# EAGLE board boatcc (EAGLE 9.2.1)
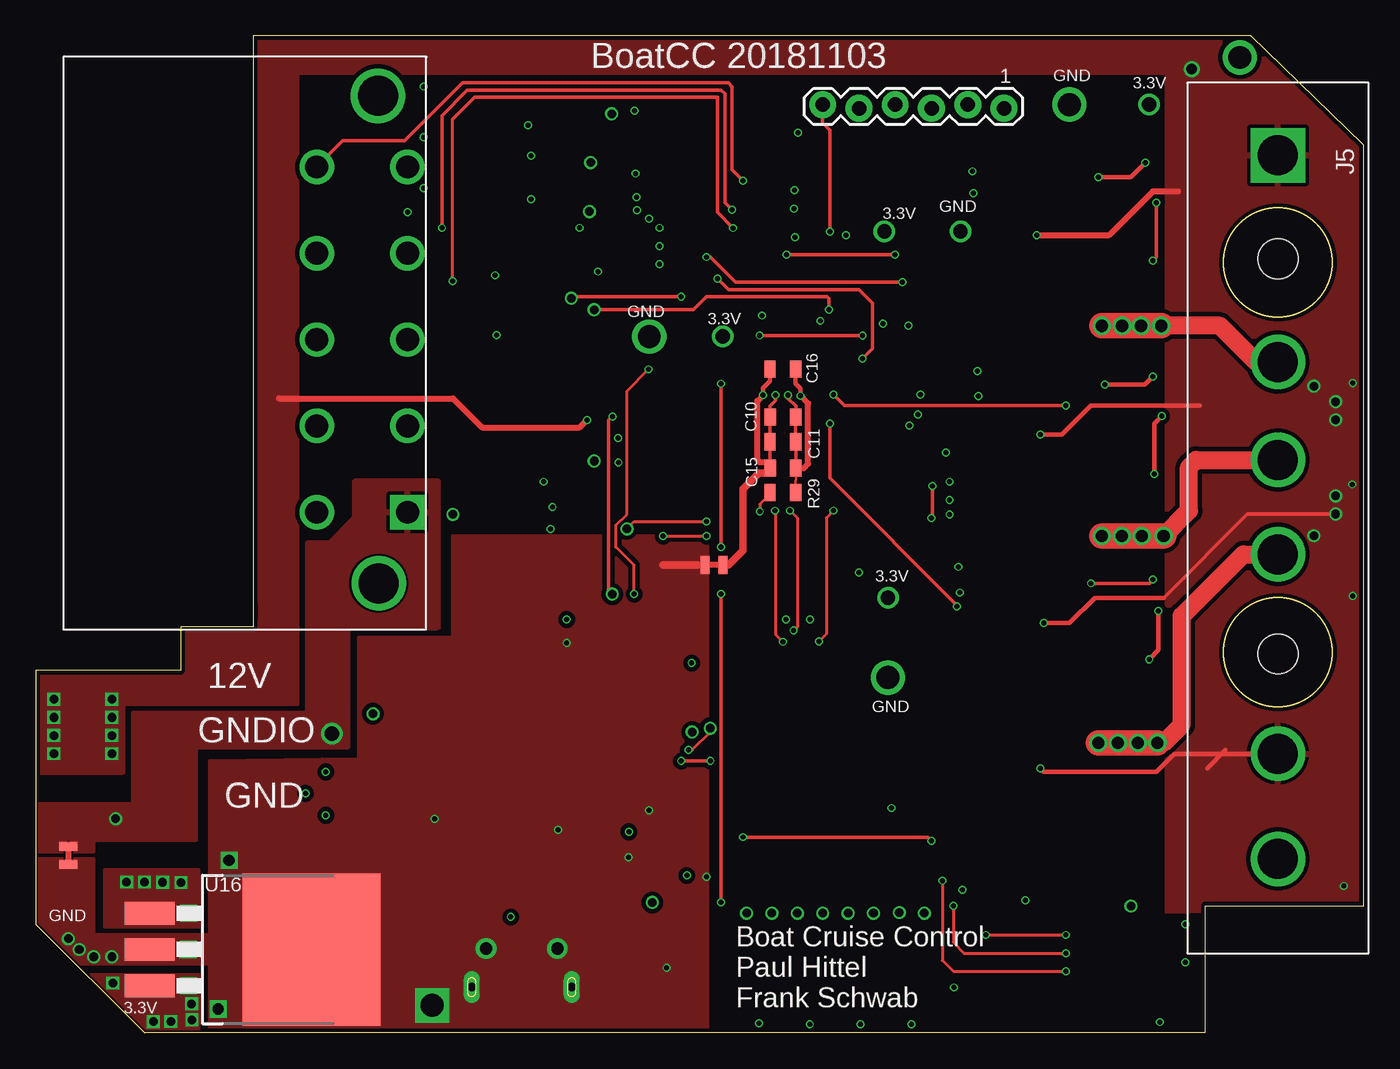
[diagram p2: board, top side]
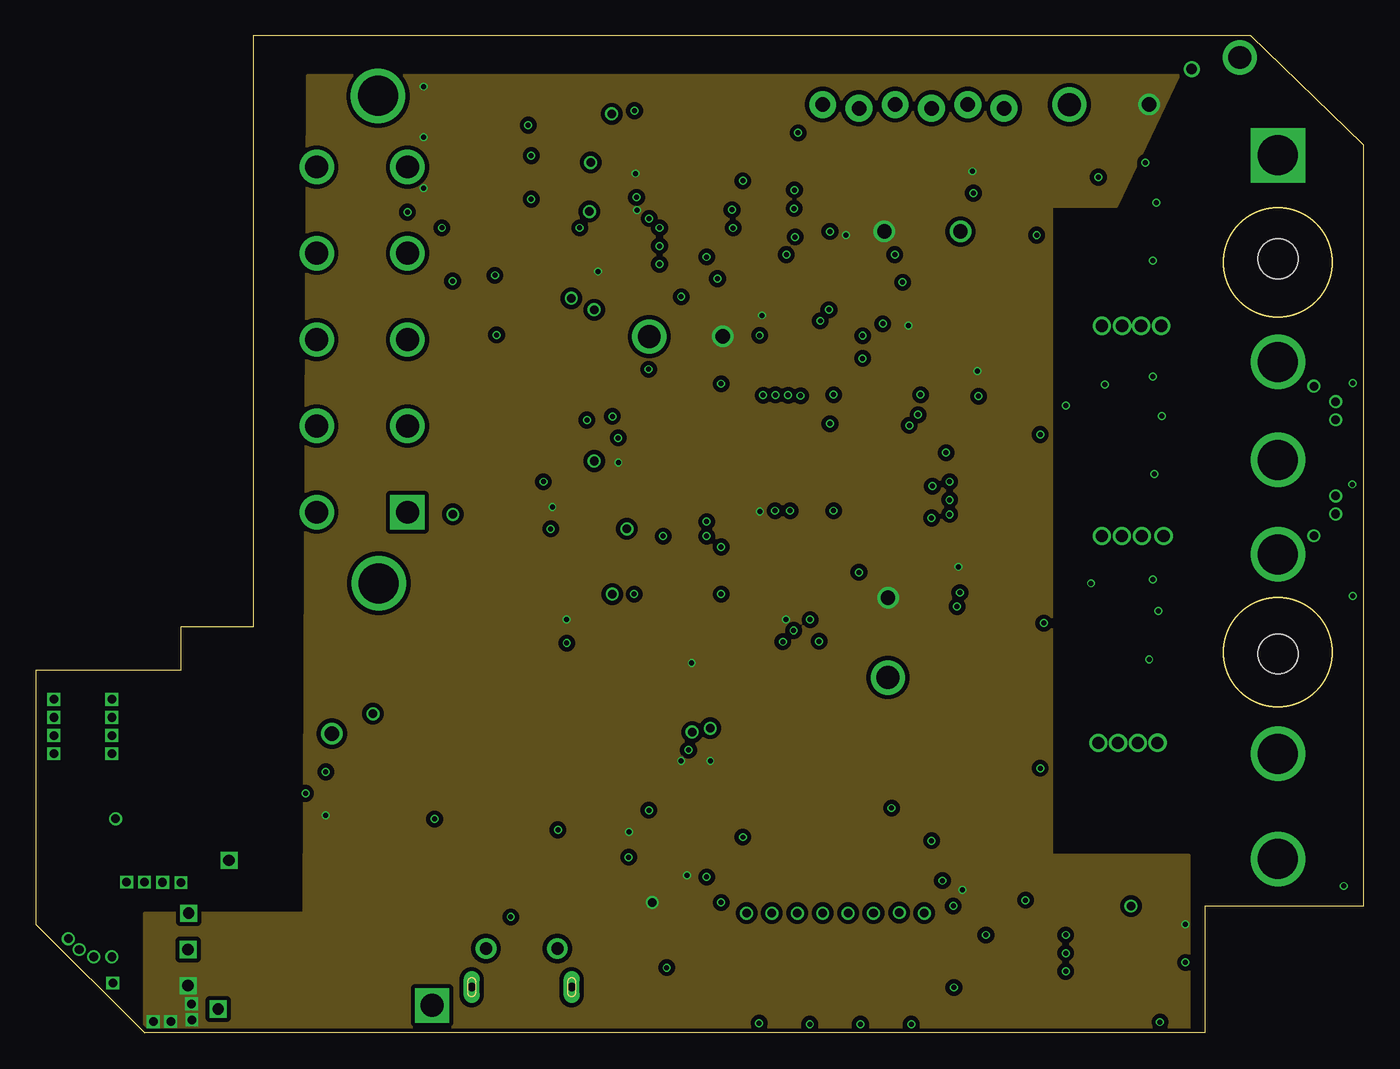
[diagram p3: board, inner layer $3.3V]
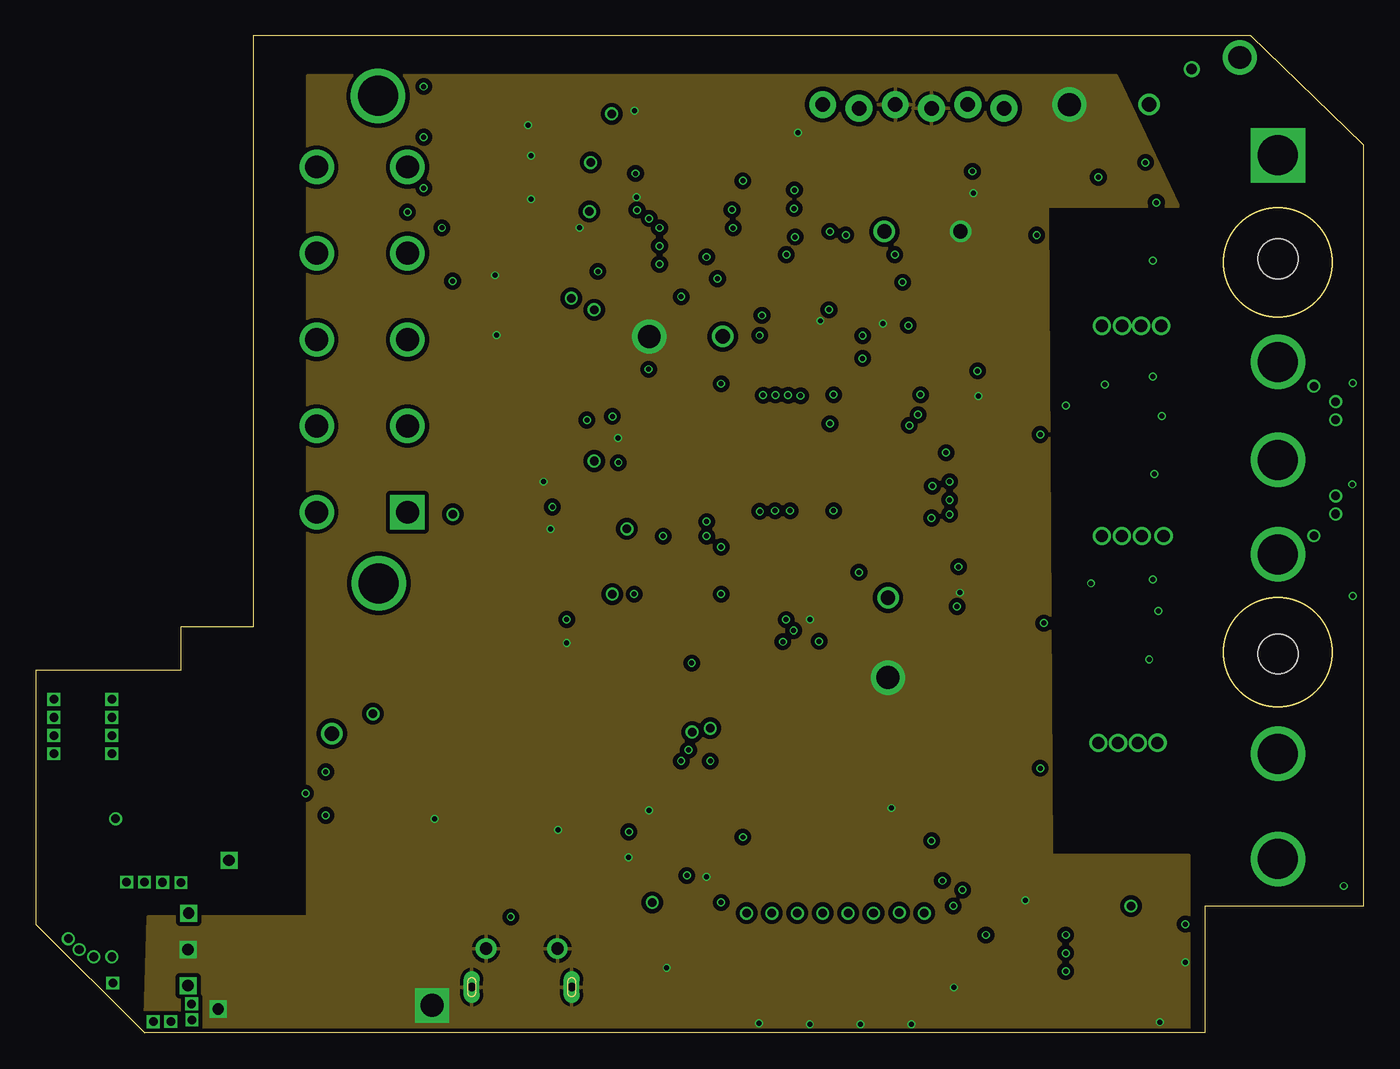
[diagram p4: board, inner layer $Gnd]
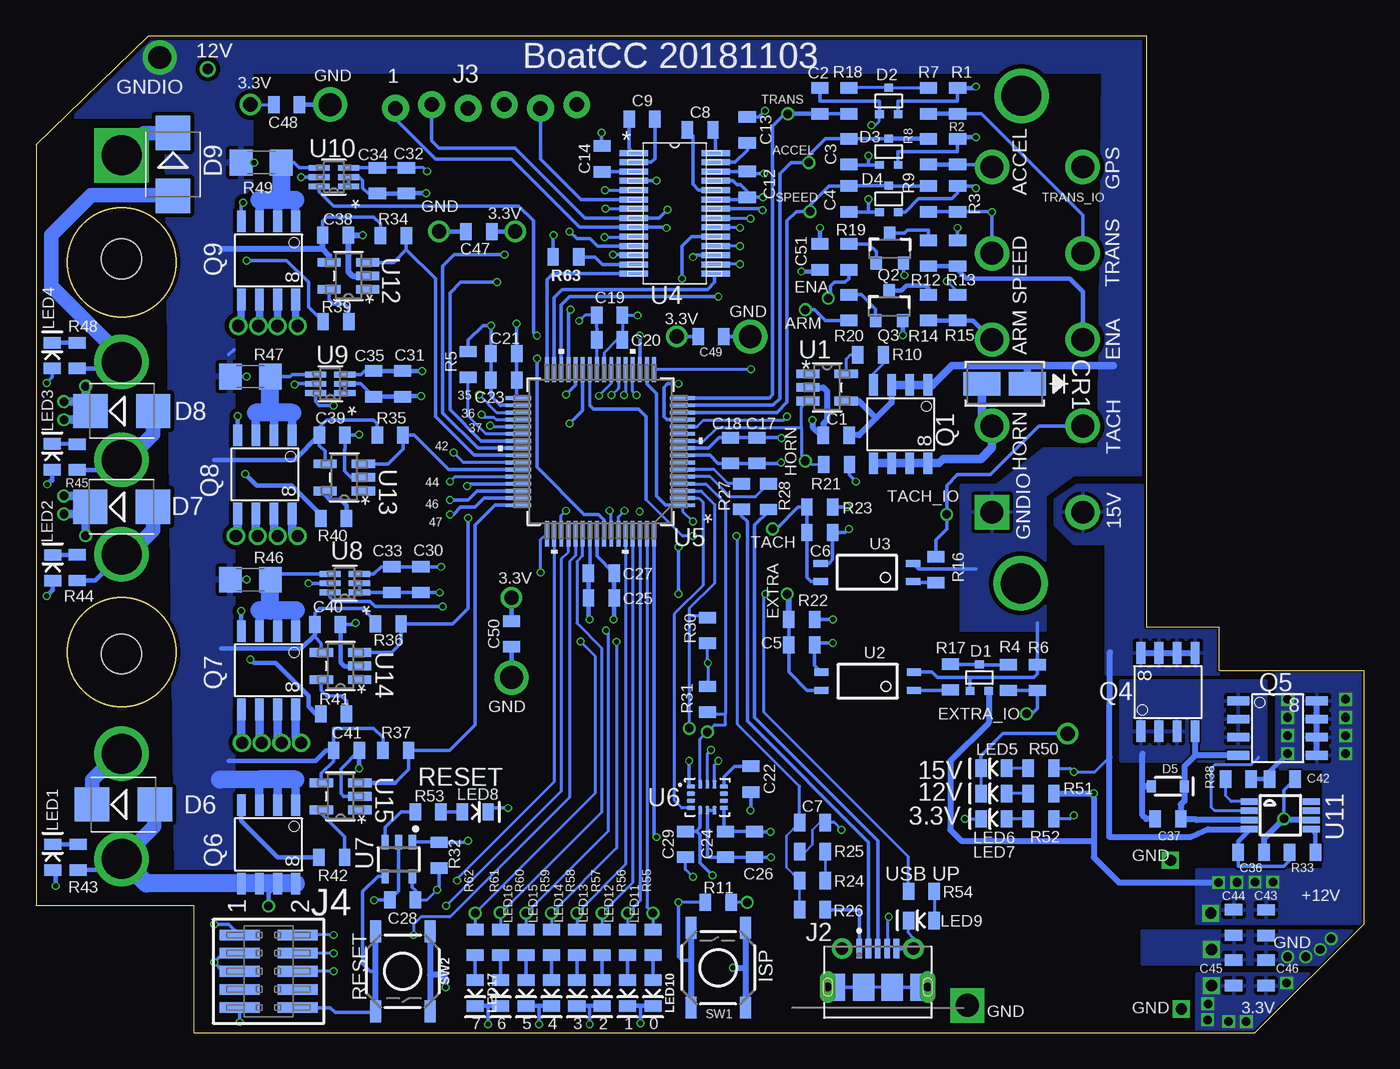
[diagram p5: board, bottom side, seen from below]

Size 93.02 x 69.85 mm. Coordinates in mm from the lower left corner, seen from the top.
Outline: 92.96,8.89 81.92,8.89 81.92,0 7.62,0 0,7.62 0,25.4 10.16,25.4 10.16,28.45 15.24,28.45 15.24,69.85 85.09,69.85 92.96,62.23 92.96,8.89
Outline: 92.96,8.89 93.02,8.89
Outline: circle at 87,26.67 radius 3.81
Outline: circle at 87,53.98 radius 3.81
Copper layers (1*2+15*16): Top 0.035mm / dielectric 0.12mm / $3.3V 0.0175mm / dielectric 1.2mm / $Gnd 0.0175mm / dielectric 0.12mm / Bottom 0.035mm
Design rules "SmartPrototypingEagle Rule_4layer": minimum track width 6mil, minimum drill 12mil, track to track 6mil, track to pad 6mil, pad to pad 6mil, via to via 6mil, smd to smd 0mil, copper to edge 6mil, drill to drill 12mil, minimum pad ring 10mil, minimum via ring 4mil, stop-mask expansion 2mil, vias tented up to drill 25mil, thermal gap 10mil

## Footprints (pad centres in the part's own frame; a part is rotated, then mirrored left to right if it is on the bottom)
0805 = smd 0.8 x 1.2: 1 -0.9,0; 2 0.9,0
SMASERIES-M = smd 2.591 x 1.651: 1 -1.6,0; 2 1.6,0
SC70 = smd 0.6 x 0.55: 1 -0.65,-0.925; 2 0.65,-0.925; 3 0,0.925
SOD-323 = smd 0.63 x 0.83: A 1.15,0; C -1.15,0
SMB = smd 2.4 x 2.4: A 2.2,0; C -2.2,0
CONN_IO = drill 1.6 square: A 18.136,6.35 | drill 1.6: B 12.09,6.35; C 6.045,6.35; D 0,6.35; E -6.045,6.35; F -6.045,0; G 0,0; H 6.045,0; J 12.09,0; K 18.136,0 | drill 2.8: LOC1 -11.024,4.293; LOC2 23.114,4.343
MOLEX_1050170001 = smd 0.4 x 1.35: 1 -1.3,2.35; 2 -0.65,2.35; 3 0,2.35; 4 0.65,2.35; 5 1.3,2.35 | drill 0.85 pad 1.45: SH1 -2.5,2.35; SH2 2.5,2.35 | drill 0.6 pad 0.95 long: SH3 -3.5,-0.35; SH8 3.5,-0.35 | smd 1.2 x 1.9: SH4 -2.9,-0.35; SH7 2.9,-0.35 | smd 1.5 x 1.9: SH5 -1,-0.35; SH6 1,-0.35
1X06_LOCK = drill 1.016 pad 1.88: 1 0,0; 2 2.54,-0.254; 3 5.08,0; 4 7.62,-0.254; 5 10.16,0; 6 12.7,-0.254
SAMTEC-FTSH-105-01-X-DV = smd 0.74 x 2.79: 1 -2.54,-2.032; 2 -2.54,2.032; 3 -1.27,-2.032; 4 -1.27,2.032; 5 0,-2.032; 6 0,2.032; 7 1.27,-2.032; 8 1.27,2.032; 9 2.54,-2.032; 10 2.54,2.032
CONN_MOTOR = drill 2.8 square: 1 0,0 | drill 2.8: 2 14.478,0; 3 21.336,0; 4 27.94,0; 5 41.91,0; 6 49.276,0 | hole 2.8: 7.239,0; 34.925,0
LED_0805 = smd 0.8 x 1.2: A -0.9,0; C 0.9,0
SO-8 = smd 1.524 x 0.61: 1 -2.743,1.905; 2 -2.743,0.635; 3 -2.743,-0.635; 4 -2.743,-1.905; 5 2.743,-1.905; 6 2.743,-0.635; 7 2.743,0.635; 8 2.743,1.905
SOT23-3 = smd 0.8 x 0.9: 1 -0.95,-1; 2 0.95,-1; 3 0,1.1
1206 = smd 1.6 x 1.8: 1 -1.4,0; 2 1.4,0
2PT_GND_TIE = smd 1.27 x 0.635: P$1 0,0.635; P$2 0,-0.635
TACTILE_SWITCH_SMD_5.2MM = smd 1.524 x 0.762: 1 -2.794,1.905; 2 2.794,1.905; 3 -2.794,-1.905; 4 2.794,-1.905
SOT-23-5_MC-M = smd 1.626 x 0.61: 1 -1.346,0.95; 2 -1.346,0; 3 -1.346,-0.95; 4 1.346,-0.95; 5 1.346,0.95
MINI-FLAT-4 = smd 1 x 0.5: 1 -3.24,0.635; 2 -3.24,-0.635; 3 3.24,-0.635; 4 3.24,0.635
PW28-M = smd 1.981 x 0.406: 1 -2.87,4.216; 2 -2.87,3.581; 3 -2.87,2.921; 4 -2.87,2.286; 5 -2.87,1.626; 6 -2.87,0.965; 7 -2.87,0.33; 8 -2.87,-0.33; 9 -2.87,-0.965; 10 -2.87,-1.626; 11 -2.87,-2.286; 12 -2.87,-2.921; 13 -2.87,-3.581; 14 -2.87,-4.216; 15 2.87,-4.216; 16 2.87,-3.581; 17 2.87,-2.921; 18 2.87,-2.286; 19 2.87,-1.626; 20 2.87,-0.965; 21 2.87,-0.33; 22 2.87,0.33; 23 2.87,0.965; 24 2.87,1.626; 25 2.87,2.286; 26 2.87,2.921; 27 2.87,3.581; 28 2.87,4.216
LQFP64_10X10-M = smd 1.766 x 0.27: 1 -5.751,3.75; 2 -5.751,3.25; 3 -5.751,2.75; 4 -5.751,2.25; 5 -5.751,1.75; 6 -5.751,1.25; 7 -5.751,0.75; 8 -5.751,0.25; 9 -5.751,-0.25; 10 -5.751,-0.75; 11 -5.751,-1.25; 12 -5.751,-1.75; 13 -5.751,-2.25; 14 -5.751,-2.75; 15 -5.751,-3.25; 16 -5.751,-3.75; 33 5.751,-3.75; 34 5.751,-3.25; 35 5.751,-2.75; 36 5.751,-2.25; 37 5.751,-1.75; 38 5.751,-1.25; 39 5.751,-0.75; 40 5.751,-0.25; 41 5.751,0.25; 42 5.751,0.75; 43 5.751,1.25; 44 5.751,1.75; 45 5.751,2.25; 46 5.751,2.75; 47 5.751,3.25; 48 5.751,3.75 | smd 0.27 x 1.766: 17 -3.75,-5.751; 18 -3.25,-5.751; 19 -2.75,-5.751; 20 -2.25,-5.751; 21 -1.75,-5.751; 22 -1.25,-5.751; 23 -0.75,-5.751; 24 -0.25,-5.751; 25 0.25,-5.751; 26 0.75,-5.751; 27 1.25,-5.751; 28 1.75,-5.751; 29 2.25,-5.751; 30 2.75,-5.751; 31 3.25,-5.751; 32 3.75,-5.751; 49 3.75,5.751; 50 3.25,5.751; 51 2.75,5.751; 52 2.25,5.751; 53 1.75,5.751; 54 1.25,5.751; 55 0.75,5.751; 56 0.25,5.751; 57 -0.25,5.751; 58 -0.75,5.751; 59 -1.25,5.751; 60 -1.75,5.751; 61 -2.25,5.751; 62 -2.75,5.751; 63 -3.25,5.751; 64 -3.75,5.751
PQFN50P250X300X97-14N = smd 0.61 x 0.3: 1 -1.16,0.75; 2 -1.16,0.25; 3 -1.16,-0.25; 4 -1.16,-0.75; 8 1.16,-0.75; 9 1.16,-0.25; 10 1.16,0.25; 11 1.16,0.75 | smd 0.3 x 0.61: 5 -0.5,-0.91; 6 0,-0.91; 7 0.5,-0.91; 12 0.5,0.91; 13 0,0.91; 14 -0.5,0.91
SOT23-5 = smd 0.5 x 1: 1 -0.95,-1.2; 2 0,-1.2; 3 0.95,-1.2; 4 0.95,1.2; 5 -0.95,1.2
DCK6-M = smd 1.473 x 0.406: 1 -1.029,0.65; 2 -1.029,0; 3 -1.029,-0.65; 4 1.029,-0.65; 5 1.029,0; 6 1.029,0.65
UMAX8 = smd 0.45 x 1.2: 1 -0.975,-2.175; 2 -0.325,-2.175; 3 0.325,-2.175; 4 0.975,-2.175; 5 0.975,2.175; 6 0.325,2.175; 7 -0.325,2.175; 8 -0.975,2.175
D2PACK/A = smd 1.6 x 3.5: 1 -2.54,-8.275; 2 0,-8.275; 3 2.54,-8.275 | smd 10.668 x 9.652: TAB 0,3.08

## Placement (x,y rotation side)
C1  100nf  [0805]  36.95,41.86 0 bottom
C2  100nf  [0805]  38.1,65.28 90 bottom
C3  100nf  [0805]  36.07,61.72 270 bottom
C4  100nf  [0805]  36.07,58.42 270 bottom
C5  100nf  [0805]  39.37,27.18 0 bottom
C6  100nf  [0805]  38.1,35.05 0 bottom
C7  100nf  [0805]  38.61,14.73 0 bottom
C8  100nf  [0805]  46.48,63.25 180 bottom
C9  100nf  [0805]  50.55,64.01 0 bottom
C10  1uf  [0805]  52.33,43.14 0 top
C11  10nf  [0805]  52.32,41.4 0 top
C12  100nf  [0805]  43.18,59.44 270 bottom
C13  100nf  [0805]  43.18,63.25 90 bottom
C14  100nf  [0805]  53.34,61.21 90 bottom
C15  10uf  [0805]  52.33,39.57 180 top
C16  100nf  [0805]  52.33,46.5 180 top
C17  100nf  [0805]  42.5,40.8 90 bottom
C18  10nf  [0805]  44.36,40.8 90 bottom
C19  100nf  [0805]  52.83,50.27 180 bottom
C20  10nf  [0805]  52.83,48.55 180 bottom
C21  100nf  [0805]  60.23,47.59 0 bottom
C22  100nf  [0805]  42.93,17.78 270 bottom
C23  10nf  [0805]  60.23,45.72 0 bottom
C24  100nf  [0805]  44.7,13.21 270 bottom
C25  100nf  [0805]  53.4,30.46 180 bottom
C26  1uf  [0805]  42.67,13.21 270 bottom
C27  10nf  [0805]  53.41,32.19 180 bottom
C28  100nf  [0805]  67.32,9.32 180 bottom
C29  10nf  [0805]  47.51,13.21 270 bottom
C30  100nf  [0805]  66.04,31.75 90 bottom
C31  100nf  [0805]  67.31,45.47 90 bottom
C32  100nf  [0805]  67.06,59.69 90 bottom
C33  10nf  [0805]  68.07,31.75 90 bottom
C34  10nf  [0805]  69.09,59.69 90 bottom
C35  10nf  [0805]  69.34,45.47 90 bottom
C36  100nf  [0805]  7.9,12.65 0 bottom
C37  10nf  [0805]  13.72,14.99 0 bottom
C38  100nf  [0805]  72.02,55.88 180 bottom
C39  100nf  [0805]  72.25,41.87 180 bottom
C40  100nf  [0805]  72.56,28.61 180 bottom
C41  100nf  [0805]  71.25,19.78 180 bottom
C42  10uf  [0805]  5.7,17.78 0 bottom
C43  10uf  [0805]  6.85,7.72 270 bottom
C44  100nf  [0805]  9.12,7.74 270 bottom
C45  100nf  [0805]  9.12,4.21 90 bottom
C46  10uf  [0805]  6.85,4.21 90 bottom
C47  1uf  [0805]  61.98,56.13 180 bottom
C48  10uf  [0805]  75.44,65.02 0 bottom
C49  1uf  [0805]  45.72,48.77 0 bottom
C50  1uf  [0805]  59.69,27.94 270 bottom
C51  10uf  [0805]  38.1,54.36 90 bottom
CR1  SMAJ45CASMASERIES-M  [SMASERIES-M]  25.15,45.47 180 bottom
D1  BAV99WT1  [SC70]  26.92,24.89 0 bottom
D2  BAV99WT1  [SC70]  33.27,65.28 0 bottom
D3  BAV99WT1  [SC70]  33.27,61.72 0 bottom
D4  BAV99WT1  [SC70]  33.27,58.42 0 bottom
D5  18V  [SOD-323]  13.72,17.27 180 bottom
D6  ES2D  [SMB]  86.87,16 0 bottom
D7  ES2D  [SMB]  86.99,36.85 0 bottom
D8  ES2D  [SMB]  86.99,43.56 0 bottom
D9  ES2D  [SMB]  83.4,60.83 270 bottom
J1  CONN_IOALT  [CONN_IO]  19.68,54.61 270 top
J2  CONN_USB_MICRO  [MOLEX_1050170001]  34.04,3.56 0 bottom
J3  CONN_SERIAL  [1X06_LOCK]  67.82,64.77 180 top
J4  FTSH-105-01  [SAMTEC-FTSH-105-01-X-DV]  76.71,4.32 270 bottom
J5  CONN_MOTOR  [CONN_MOTOR]  87,61.47 270 top
LED1  Green  [LED_0805]  91.83,12.31 90 bottom
LED2  Green  [LED_0805]  91.83,32.58 90 bottom
LED3  Green  [LED_0805]  91.85,40.36 90 bottom
LED4  Green  [LED_0805]  91.85,47.45 90 bottom
LED5  Green  [LED_0805]  25.91,18.54 180 bottom
LED6  Green  [LED_0805]  25.91,16.76 180 bottom
LED7  Green  [LED_0805]  25.91,14.99 180 bottom
LED8  Red  [LED_0805]  62.23,15.49 0 bottom
LED9  Green  [LED_0805]  30.99,7.87 180 bottom
LED10  Green  [LED_0805]  49.78,2.79 270 bottom
LED11  Green  [LED_0805]  51.56,2.79 270 bottom
LED12  Green  [LED_0805]  53.34,2.79 270 bottom
LED13  Green  [LED_0805]  55.12,2.79 270 bottom
LED14  Green  [LED_0805]  56.9,2.79 270 bottom
LED15  Green  [LED_0805]  58.67,2.79 270 bottom
LED16  Green  [LED_0805]  60.45,2.79 270 bottom
LED17  Red  [LED_0805]  62.23,2.79 270 bottom
Q1  SI4190DY  [SO-8]  32.44,42.65 270 bottom
Q2  2N3904  [SOT23-3]  33.19,54.91 0 bottom
Q3  2N3904  [SOT23-3]  33.24,50.88 0 bottom
Q4  SI4190DY  [SO-8]  13.72,23.88 90 bottom
Q5  SI4190DY  [SO-8]  6.04,21.34 0 bottom
Q6  SI4190DY  [SO-8]  76.71,13.21 270 bottom
Q7  SI4190DY  [SO-8]  76.71,25.4 270 bottom
Q8  SI4190DY  [SO-8]  76.96,39.12 270 bottom
Q9  SI4190DY  [SO-8]  76.71,54.1 270 bottom
R1  1k  [0805]  28.45,65.28 270 bottom
R2  49.9  [0805]  28.45,61.72 270 bottom
R3  49.9  [0805]  28.45,58.42 270 bottom
R4  DNP  [0805]  22.86,24.89 90 bottom
R5  10k  [0805]  62.74,46.83 270 bottom
R6  1k  [0805]  24.89,24.89 270 bottom
R7  1k  [0805]  30.48,65.28 270 bottom
R8  4k7  [0805]  30.48,61.72 270 bottom
R9  4k7  [0805]  30.48,58.42 270 bottom
R10  33  [0805]  34.54,47.5 180 bottom
R11  10k  [0805]  45.21,9.14 0 bottom
R12  620  [0805]  30.48,54.61 270 bottom
R13  DNP  [0805]  28.45,54.61 270 bottom
R14  620  [0805]  30.48,50.8 270 bottom
R15  DNP  [0805]  28.45,50.8 270 bottom
R16  1k  [0805]  29.97,32.44 90 bottom
R17  1k  [0805]  28.95,24.92 90 bottom
R18  1k  [0805]  36.07,65.28 90 bottom
R19  1k  [0805]  36.07,54.36 90 bottom
R20  1k  [0805]  36.07,50.8 90 bottom
R21  10k  [0805]  36.92,39.82 0 bottom
R22  1k  [0805]  39.37,28.96 0 bottom
R23  1k  [0805]  38.1,36.83 0 bottom
R24  10k  [0805]  38.61,10.67 180 bottom
R25  10k  [0805]  38.61,12.7 0 bottom
R26  10k  [0805]  38.61,8.64 0 bottom
R27  33  [0805]  43.58,37.58 90 bottom
R28  33  [0805]  41.69,37.56 90 bottom
R29  100  [0805]  52.32,37.84 0 top
R30  10k  [0805]  45.97,28.19 270 bottom
R31  10k  [0805]  45.97,23.37 90 bottom
R32  10k  [0805]  64.77,12.45 90 bottom
R33  10k  [0805]  4.29,12.65 0 bottom
R34  10k  [0805]  67.97,55.84 180 bottom
R35  10k  [0805]  68.19,41.87 180 bottom
R36  10k  [0805]  68.32,28.63 180 bottom
R37  10k  [0805]  67.8,19.8 180 bottom
R38  100  [0805]  8.8,17.78 0 bottom
R39  33  [0805]  71.98,49.81 180 bottom
R40  33  [0805]  72.15,36.04 180 bottom
R41  33  [0805]  72.15,22.35 180 bottom
R42  33  [0805]  72.28,12.3 180 bottom
R43  3k  [0805]  90.03,12.31 90 bottom
R44  1k  [0805]  90.11,32.59 90 bottom
R45  1k  [0805]  90.12,40.33 90 bottom
R46  R015  [1206]  77.98,31.75 0 bottom
R47  R015  [1206]  77.98,45.97 0 bottom
R48  1k  [0805]  90.12,47.45 90 bottom
R49  R015  [1206]  77.22,60.96 0 bottom
R50  3k  [0805]  22.61,18.54 0 bottom
R51  3k  [0805]  22.61,16.76 0 bottom
R52  350  [0805]  22.61,14.99 0 bottom
R53  350  [0805]  65.53,15.49 180 bottom
R54  350  [0805]  30.99,9.91 180 bottom
R55  350  [0805]  49.78,6.35 90 bottom
R56  350  [0805]  51.56,6.35 90 bottom
R57  350  [0805]  53.34,6.35 90 bottom
R58  350  [0805]  55.12,6.35 90 bottom
R59  350  [0805]  56.9,6.35 90 bottom
R60  350  [0805]  58.67,6.35 90 bottom
R61  350  [0805]  60.45,6.35 90 bottom
R62  350  [0805]  62.23,6.35 90 bottom
R63  10k  [0805]  55.88,54.36 180 bottom
SUPPLY1  2PT_GND_TIE  [2PT_GND_TIE]  47.5,32.77 270 top
SUPPLY2  2PT_GND_TIE  [2PT_GND_TIE]  2.29,12.45 0 top
SW1  [TACTILE_SWITCH_SMD_5.2MM]  45.21,4.57 90 bottom
SW2  [TACTILE_SWITCH_SMD_5.2MM]  67.31,4.32 270 bottom
U1  MCP1416  [SOT-23-5_MC-M]  37.59,45.21 0 bottom
U2  TLP292  [MINI-FLAT-4]  34.75,24.63 180 bottom
U3  TLP292  [MINI-FLAT-4]  34.8,32.26 180 bottom
U4  MAX3243  [PW28-M]  48.26,57.4 0 bottom
U5  LPC54114  [LQFP64_10X10-M]  53.46,40.71 180 bottom
U6  ICM-20600  [PQFN50P250X300X97-14N]  45.97,16.51 0 bottom
U7  MCP1319M  [SOT23-5]  67.59,12.17 180 bottom
U8  INA213B  [DCK6-M]  71.37,31.5 180 bottom
U9  INA213B  [DCK6-M]  72.39,45.47 180 bottom
U10  INA213B  [DCK6-M]  72.14,59.94 180 bottom
U11  MAX16128  [UMAX8]  5.84,15.24 270 bottom
U12  MCP1416  [SOT-23-5_MC-M]  71.11,53.02 180 bottom
U13  MCP1416  [SOT-23-5_MC-M]  71.41,38.91 180 bottom
U14  MCP1416  [SOT-23-5_MC-M]  71.67,25.7 180 bottom
U15  MCP1416  [SOT-23-5_MC-M]  71.66,16.57 180 bottom
U16  Recom R-78E3.3-0.5  [D2PACK/A]  16.26,5.84 270 top

## Tracks (layer width: path | path; a pad name or v marks a point on that pad's centre or on a via)
3.3V  (via drill 0.35, 0.6, 0.8, 1)
  Top 0.203: R29.1 51.13,37.55 51.13,37.46 50.71,37.04 v50.71,36.53
  Top 0.254: v45.21,19.05 v47.24,19.05
  Bottom 0.203: v43.18,9.14 R11.2 | R52.2 20.57,14.99 v20.32,15.24 | v77.98,65.02 C48.1 | U5.24 53.21,47.63 52.29,48.55 C20.1 C19.1 v50.87,50.27 v50.87,50.26 | C28.1 65.61,9.32 v64.91,10.02 | R30.2 45.97,25.94 v45.95,25.91 45.95,24.3 R31.2 | v65.6,60.34 65.85,60.59 C32.2 C34.2 | U6.12 45.47,18.79 v45.21,19.05
  Bottom 0.254: v27.18,59.18 27.32,59.32 R3.1 28.45,58.81 28.84,58.42 31.19,58.42 32.12,57.49 D4.2 | U4.26 45.43,60.34 C12.1 43.18,60.2 v42.01,60.2 | v40.8,39.94 40.85,39.9 C17.1 C18.1 45.23,39.9 45.8,40.46 U5.8 | R2.1 28.45,61.72 32.62,61.72 D3.2 | R1.1 28.45,65.28 32.62,65.28 D2.2 | C27.1 53.71,33.4 U5.56 | C49.1 46.63,48.78 v48.12,48.78 | v80.52,7.62 79.5,7.62 J4.1 | U4.22 42.22,57.73 v42.12,57.63 | v41.54,14.08 42.65,14.08 C26.1 C24.1 44.81,14.22 U6.8 | C28.1 66.42,9.99 66.64,10.21 U7.5 | U5.34 60.43,43.96 60.45,43.94 61.13,44.62 C23.1 C21.1 61.11,47.6 v61.11,49.56 61.7,49.56 62.74,48.51 R5.1 | C29.1 46.75,14.11 | 46.75,14.11 46.5,13.86 46.5,11.93 v45.61,11.03 | v64.91,10.02 64.77,10.16 R32.1 | U8.3 69.34,32.15 68.83,32.65 C33.2 C30.2 v64.64,32.65 | 46.75,14.11 46.47,14.39 U6.5 | U6.1 47.24,17.37 v47.24,19.05 | R23.2 v36.19,36.83 v36.18,36.84 | v37.19,28.96 R22.2 | C35.2 69.97,46.37 70.22,46.12 U9.3 | C34.2 U10.3 | R63.2 56.78,55.84 v56.74,55.88
  Bottom 0.305: v27.18,62.74 28.33,62.74 R2.1 | R1.1 27.29,66.18 v27.18,66.29 | v39.37,53.34 38.22,53.34 C51.1 | v52.55,28.96 52.5,29.01 C25.1 52.5,32.19 C27.1 | v59.44,56.13 C47.1 | C50.1 v59.69,30.48 | v65.96,46.37 C31.2 C35.2
  other vias: 10.67,3.31 10.94,0.91 9.46,0.8 10.92,2.03 8.24,0.79 5.41,3.49
  pour Bottom: 11.68,4.11 3.02,4.11 5.08,0 11.68,0
  pour $3.3V (isolate 0.305): 19.05,67.06 80.01,67.06 75.69,57.91 71.12,57.91 71.12,12.45 80.77,12.45 80.77,0 7.62,0 7.62,8.38 18.8,8.38
  pour Top (no thermals): 11.43,4.06 2.92,4.06 4.95,0 11.43,0
+12V  (via drill 0.35, 0.6, 0.75, 0.8)
  Top 0.254: v91.05,36.34 84.86,36.34 78.99,30.48
  Top 0.305: 81.53,43.94 73.91,43.94 71.88,41.91 v70.36,41.91 | 82.04,18.54 83.31,19.81 | J5.5 79.76,19.56 78.49,18.29 70.61,18.29 v70.36,18.54 | v70.61,28.7 72.39,28.7 74.17,30.48 78.99,30.48
  Top 0.406: v38.61,42.93 38.1,42.42 31.25,42.42 29.22,44.45 17.02,44.45 | 80.01,58.93 78.23,58.93 75.18,55.88 v70.1,55.88
  Bottom 0.203: 18.91,16.51 18.9,16.53 v18.9,16.78 18.91,16.76
  Bottom 0.254: v92.25,45.53 91.85,45.93 LED4.A | U13.2 70.92,38.91 71.37,39.37 71.37,40.89 71.35,40.91 C39.1 70.4,41.87 v70.36,41.91 | v70.11,55.88 v70.1,55.88 | C38.1 | U14.2 70.36,25.65 | C40.1 70.7,28.61 v70.61,28.7 | C41.1 71.63,18.5 71.63,16.76 71.43,16.57 U15.2
  Bottom 0.305: v5.33,19.56 6.6,18.29 C42.1 R38.2 | 70.36,25.65 71.37,25.65 71.66,25.94 C40.1 | v91.62,10.29 91.62,11.21 LED1.A | LED3.A 91.85,38.68 91.95,38.68 v92.2,38.43 | LED2.A 91.83,31.01 v92.24,30.6 | v70.36,18.54 v70.35,18.55 C41.1
  Bottom 0.406: Q5.5 Q5.6 Q5.7 Q5.8 | 18.91,16.51 18.91,13.46 | 18.91,13.46 18.91,12.31 17.14,10.53 v10.17,10.53 | R51.2 18.91,16.76 | C38.1 v70.11,55.88 | C38.1 71.12,53.34 70.8,53.02 U12.2 | v38.61,42.93 38.61,42.42 38.05,41.86 C1.1 37.85,42.67 37.59,42.93 37.59,44.96 37.85,45.21 U1.2 | D1.2 26.27,21.73 28.96,19.05 28.96,14.22 28.19,13.46 18.91,13.46
  Bottom 0.61: D8.C 89.52,43.9 v89.52,45.3 | D8.C 89.84,44.22 v91.05,44.22 | D8.C 89.8,42.95 v91.05,42.95 | D7.C 89.52,36.52 v89.52,34.82 | D7.C 89.7,36.34 v91.05,36.34 | D7.C 89.96,37.62 v91.05,37.62
  Bottom 1.016: D6.C 89.07,17.74 87.25,19.56 J5.5 | D9.C 85.43,63.03 J5.1
  other vias: 1.27,19.56 1.27,20.83 1.27,22.1 1.27,23.37 5.33,23.37 5.33,22.1 5.33,20.83 6.36,10.56 7.62,10.56 8.89,10.55 80.96,67.52 10.72,8.38
  pour Top (isolate 0.305): 94.77,8.9 93.47,69.85 15.24,69.85 15.75,28.7 -0.51,28.7 -0.25,18.29 6.1,18.29 6.1,23.11 18.29,23.11 18.29,67.31 79.25,67.31 79.25,8.55
  pour Bottom: -0.25,25.4 6.1,25.4 6.1,18.55 2.79,18.54 2.79,11.43 11.68,11.43 11.68,7.69 -0.25,7.69
  pour Top (no thermals): 4.83,11.43 4.83,7.44 11.43,7.44 11.43,11.43
+15V  (via drill 0.35)
  Bottom 0.203: R50.2 20.57,18.54 v20.32,18.29 18.82,18.29 17.81,19.3
  Bottom 0.254: C36.1 8.79,11.68 5.59,11.68 5.2,12.08 R33.1
  Bottom 0.305: C36.1 8.79,13.41 8.05,14.15 8.05,14.27
  Bottom 0.406: Q4.8 Q4.5 | 17.78,26.67 17.81,19.3 17.83,13.75 12.09,13.75 10.91,14.27 8.05,14.27 U11.4
  pour Bottom: 10.16,25.15 10.16,28.45 15.49,38.35 20.07,38.35 21.59,37.34 21.59,35.56 20.32,34.29 18.03,34.29 18.03,25.15
ACC_INT
  Bottom 0.203: U5.2 46.57,37.46 46.29,37.19 46.29,31.34 48.26,29.37 48.26,16.26 47.76,15.76 U6.4
ACC_SCL  (via drill 0.35, 0.6)
  Top 0.203: v47.24,21.34 47.24,21.08 45.97,19.81 v45.72,19.81
  Bottom 0.203: U5.3 46.41,37.96 45.47,37.02 45.47,31.5 47.24,29.72 47.24,29.21 | 47.24,29.21 v47.24,21.34 | R30.1 46.09,29.21 47.24,29.21 | U6.13 45.97,19.56 v45.72,19.81
ACC_SDA  (via drill 0.6)
  Bottom 0.203: U5.4 46.08,38.46 44.7,37.08 44.7,22.35 | 44.7,22.35 44.7,21.59 45.47,21.59 v45.97,21.08 46.47,20.58 U6.14 | R31.1 45.86,22.35 44.7,22.35
ACCEL  (via drill 0.6)
  Bottom 0.254: U5.15 41.38,43.97 40.89,44.45 40.89,60.2 40.13,60.96 v38.86,60.96 38.86,61.47 37.71,62.62 C3.1 D3.3
  Bottom 0.305: R8.1 33.27,62.62 D3.3
ACCEL_IO
  Bottom 0.254: J1.E 26.2,60.82 R2.2
  Bottom 0.305: R2.2 R8.2
AD0.1  (via drill 0.35)
  Top 0.254: v57.92,48.84 50.73,48.84 v50.71,48.86
  Bottom 0.254: v50.71,48.86 U5.19 | v57.92,48.84 58.15,49.07 58.15,56.88 59.18,57.91 72.14,57.91 73.17,58.94 U10.6
AD0.2  (via drill 0.35)
  Top 0.254: v72.14,43.94 56.64,43.94 v55.88,44.7
  Bottom 0.254: U5.28 55.21,45.38 v55.88,44.7 | v72.14,43.94 73.15,43.94 73.42,44.21 U9.6
AD0.3  (via drill 0.35)
  Top 0.254: v55.63,42.67 55.63,38.86 64.53,29.96 v64.53,29.87
  Bottom 0.254: U5.27 54.71,43.59 v55.63,42.67 | U8.6 72.4,30.49 72.14,30.23 69.6,30.23 69.24,29.87 v64.53,29.87
AGND  (via drill 0.35)
  Top 0.254: C15.2 C11.1 C10.1 51.43,43.91 51.81,44.28 v51.81,44.69
  Top 0.305: C16.2 51.43,45.66 50.94,45.17 v50.94,44.67
  Top 0.406: C15.2 51.43,39.75 51.22,39.96 50.72,39.96 50.55,40.13 50.55,44.27 v50.94,44.67
  Top 0.508: C15.2 51.08,39.22 50.65,39.22 49.53,38.1 49.53,33.78 48.51,32.77 SUPPLY1.P$1
  Bottom 0.203: U5.21 51.71,44.79 | v50.94,44.67 51.21,44.93 U5.20
  Bottom 0.305: 51.71,44.79 v51.81,44.69
CLUTCH
  Bottom 0.254: 67.83,17.52 66.9,18.45 R37.1 64.03,19.8 62.23,21.59 62.23,35.56 60.83,36.96 U5.48
  Bottom 0.305: 67.83,17.52 U15.3
CLUTCH2  (via drill 0.6)
  Bottom 0.305: R43.1 87.78,11.41 J5.6 | v76.71,8.89 76.71,9.83 Q6.7
  Bottom 0.813: D6.A 84.71,15.99
  Bottom 1.016: 84.71,15.99 84.71,14.48 J5.6
  Bottom 1.27: Q6.8 Q6.7 Q6.6 Q6.5 85.27,10.46 J5.6
DM
  Bottom 0.254: J2.2 34.69,7.37 34.69,13.35 43.18,21.84 43.18,35.81 43.58,36.21 R27.1
DP
  Bottom 0.254: J2.3 34.04,13.46 42.67,22.1 42.67,35.56 41.69,36.54 R28.1
EXTRA  (via drill 0.35, 0.6)
  Top 0.254: v40.39,30.73 40.13,30.99 40.13,42.93 v40.39,43.18
  Bottom 0.203: U5.12 46.69,42.46 46.23,42.93 40.64,42.93 v40.39,43.18
  Bottom 0.254: U2.4 38.98,24 40.27,25.28 C5.1 R22.1
  Bottom 0.406: R22.1 40.27,30.62 v40.39,30.73
EXTRA_IO  (via drill 0.6)
  Bottom 0.254: R6.2 R4.1 22.86,22.72 23.23,22.35 v23.62,22.35
EXTRESET_N
  Bottom 0.254: J4.10 72.39,1.78 72.06,1.45 69.29,1.45 SW2.4 | U7.4 69.04,10.97 70.1,9.91 70.1,4.83 69.6,4.32 69.22,4.32
  Bottom 0.406: SW2.4 69.22,4.32 SW2.3
FILTER_IN1
  Bottom 0.254: R6.1 26.9,25.79 D1.3 R17.2
GND  (via drill 0.35, 0.6, 0.8, 1, 1.6)
  Top 0.508: SUPPLY1.P$2 43.94,32.77
  Bottom 0.178: R25.1 39.12,12.7 38.61,13.21 38.61,14.22 38.1,14.73 C7.2
  Bottom 0.203: C7.2 37.08,14.73 v36.58,14.22 | v40.79,41.67 40.81,41.7 | U2.3 | v27.94,14.99 LED7.C | J2.SH3 J2.SH4 | J2.SH6 J2.SH5 | U5.25 53.71,48.52 | 53.71,48.52 C20.2 | v54.94,49.88 54.55,50.27 C19.2 | 53.7,48.52 53.71,48.52 | J2.SH2 31.54,6.64 31.89,7 LED9.C | v46.99,10.92 47.51,11.45 C29.2 | v34.49,63.58 34.21,63.58 33.92,63.87 D2.1
  Bottom 0.254: C13.2 42.39,64.15 v41.94,64.6 | U4.23 43.35,58.37 C12.2 | v53.4,63.05 53.4,62.17 C14.2 | C12.2 v42.08,58.54 | v42.08,58.54 | U5.9 45.9,40.96 45.17,41.7 C18.2 C17.2 40.81,41.7 | D2.1 33.92,65.28 38.1,65.28 C2.2 | Q2.2 32.24,53.15 v32.16,53.06 | v35.56,38.61 36.02,39.07 R21.2 | U5.55 54.21,32.29 C27.2 | v42.97,48.77 C49.2 | J2.SH2 J2.5 | J2.SH6 J2.SH7 | J2.SH5 J2.SH4 | C19.2 53.7,48.52 | J4.3 79.87,5.59 v80.53,4.93 79.91,4.32 J4.5 | C12.2 43.18,58.93 43.66,59.4 43.9,59.4 44.18,59.69 U4.25 | v42.94,15.59 42.93,15.58 C22.2 | v41.53,12.31 C26.2 C24.2 45.84,12.31 45.97,12.45 U6.6 U6.7 | v69.33,9.3 69.3,9.32 C28.2 67.59,9.96 U7.2 | 69.05,58.82 C34.1 69.71,58.79 70.1,59.18 70.1,59.69 70.36,59.94 U10.2 U10.1 | v59.33,49.68 C21.2 C23.2 59.33,44.58 U5.33 | 69.34,44.61 C35.1 70.24,45.47 U9.2 U9.1 | LED8.C 61.08,15.75 v59.94,15.75 | U8.2 U8.1 C33.1 C30.1 66.03,30.84 v64.73,30.84 | v78.74,0.76 J4.9 | C4.2 36.04,57.49 34.7,57.49 | D4.1 34.7,57.49 | v34.7,58.4 34.7,57.49 | D3.1 34.7,60.8 | 34.7,60.8 36.04,60.8 C3.2 | v34.7,61.45 34.7,60.8 | v37.19,27.3 38.34,27.3 C5.2 38.47,25.75 U2.3 | U3.3 37.47,32.89 37.2,33.16 C6.2 36.32,35.05 v36.07,35.31 | v50.67,0.69 50.67,1.76 50.8,1.89 | v54.21,0.61 54.21,1.75 54.36,1.89 | v57.77,0.61 57.77,1.75 57.91,1.89 | v61.32,0.61 61.32,1.75 61.47,1.89
  Bottom 0.305: Q3.2 32.28,49.87 v32.28,48.88 | 67.61,13.35 U7.2 | v38.1,56.39 C51.2 | v54.23,28.95 54.3,29.02 C25.2 54.3,32.19 C27.2 | C48.2 v72.39,65.02 | LED12.C 54.36,1.89 LED13.C | LED14.C 57.91,1.89 LED15.C | C47.2 v64.77,56.13 | v59.69,24.89 C50.2 | v65.68,58.82 67.02,58.82 C32.1 69.02,58.79 69.05,58.82 | v66.04,44.6 67.28,44.6 C31.1 C35.1 | 62.25,1.91 LED17.C 61.47,1.89 LED16.C | LED10.C 50.8,1.89 LED11.C
  Bottom 0.406: SW1.4 43.31,4.57 | 43.31,4.57 SW1.3 | v44.2,4.57 43.31,4.57 | SW2.1 65.41,4.06 | 65.41,4.06 SW2.2 | v64.31,3.18 64.31,3.86 64.52,4.06 65.41,4.06
  other vias: 5.33,5.33 2.29,6.6 3.05,5.84 10.68,5.84 27.76,1.93 13.54,12.09 4.06,5.33 12.78,1.67
  pour Top (no thermals): -0.25,12.19 4.06,12.19 4.06,6.86 12.45,6.86 12.47,4.83 -0.23,4.83
  pour Bottom: -0.25,7.11 8.64,7.11 15.49,7.11 15.49,4.84 -0.16,4.79 -0.16,7.02
  pour Top (isolate 0.305, no thermals): 12.19,19.05 12.19,-0.38 47.06,-0.11 47.06,34.8 29.21,34.8 29.21,27.69 22.61,27.69 22.61,19.21
  pour $Gnd (isolate 0.305): 75.69,67.06 80.01,57.91 70.87,57.91 70.87,57.66 71.12,12.45 80.77,12.45 80.77,0 7.62,0 7.87,8.13 19.05,8.13 19.05,67.06
GNDIO  (via drill 0.35, 0.6, 1, 1.6)
  Top 0.254: v78.23,31.75 77.98,31.5 v73.91,31.5
  Top 0.305: v74.88,45.42 77.68,45.42 v78.23,45.97 | v74.42,59.94 76.71,59.94 v77.72,60.96
  Bottom 0.203: LED5.C LED6.C
  Bottom 0.254: v20.74,20.96 25.27,20.96 26.81,19.42 LED5.C | C42.2 5.6,16.98 v5.6,15 | 79.5,47.5 79.12,47.88 | U8.5 v73.91,31.5 | R37.2 68.7,20.69 69.34,21.34 72.15,21.34 C41.2 72.15,19.02 73.01,18.16 U15.4 | U14.4 73.01,27.29 73.46,27.74 C40.2 73.46,29.41 73.15,29.72 70.1,29.72 69.22,28.84 R36.2 | U13.4 72.75,40.75 73.15,41.15 C39.2 73.15,42.42 72.64,42.93 69.34,42.93 69.09,42.67 R35.2 | v78.23,45.97 R47.1 | C38.2 72.92,56.88 72.64,57.15 69.34,57.15 68.87,56.68 R34.2 | v77.72,60.96 R49.1 | U2.2 30.24,25.27 29.86,24.89 27.43,24.89 | U3.2 31.18,32.51 27.18,32.51 | U9.5 74.83,45.47 v74.88,45.42 | U10.5 v74.42,59.94 | 27.43,24.89 23.11,24.89 22.86,25.15 R4.2 22.86,28.7 | D1.1 27.57,24.75 27.43,24.89
  Bottom 0.305: R46.1 v78.23,31.75 | C39.2 74.89,40.13 80.52,40.13 | C40.2 73.46,27.89 74.42,26.92 80.01,26.92 | C41.2 72.67,19.78 73.41,19.05 79.5,19.05
  Bottom 0.406: U11.6 5.33,14.91 5.52,14.91 v5.6,15 7,13.6 C36.2 | Q1.3 33.07,44.15 34.16,43.05 | 34.16,43.05 35.35,41.86 C1.2 | U1.4 35.37,44.26 34.16,43.05 | U12.4 72.46,54.42 72.92,54.88 | 72.92,54.88 C38.2 | 72.92,54.88 79.99,54.88
  Bottom 0.508: 30.23,45.39 28.86,46.76 23.62,46.76 | 17.53,46.76 23.62,46.76 | 23.62,46.76 23.55,46.68 CR1.1
  Bottom 0.61: Q1.1 Q1.2 | 30.23,45.39 Q1.2 | Q1.2 Q1.3 | Q6.1 74.82,17.75 | 76.08,17.75 76.08,17.24 Q6.2 | 77.36,17.75 | 77.36,17.75 77.36,17.49 77.36,17.24 Q6.3
  Bottom 1.27: 74.82,17.75 76.08,17.75 77.36,17.75 80.12,17.74
  other vias: 84.33,68.33
  pour Bottom (isolate 0.305): 20.32,39.12 15.24,39.12 14.99,70.1 85.09,70.1 85.09,67.31 18.29,67.31 18.54,40.89 22.43,40.89 25.73,38.35 28.19,38.35 28.19,28.19 28.21,28.18 22.35,28.24 22.35,37.59
  pour Bottom (isolate 0.305): 92.48,69.85 77.98,69.85 77.98,58.67 79.25,58.67 79.25,8.89 83.06,8.89 83.79,64.26 92.94,64.26
  pour Top: 28.19,38.61 22.35,38.61 22.35,36.07 20.57,34.29 19.05,34.29 19.05,22.35 6.86,22.35 6.87,15.83 6.86,13.58 11.18,13.58 11.18,20.07 21.84,20.07 21.84,28.45 28.19,28.45
  pour Top (no thermals): -0.25,16 7.37,16 7.61,13.62 7.37,13.53 4.03,13.53 4.02,12.73 -0.27,12.72
GPS_IO  (via drill 0.35)
  Top 0.254: J1.F 21.51,62.48 25.84,62.48 29.91,66.55 48.51,66.55 48.77,66.29 48.77,60.45 v49.53,59.69
  Bottom 0.254: v49.53,59.69 U4.4
GPS_RX  (via drill 0.35)
  Top 0.254: v47.75,52.83 48.51,52.07 57.66,52.07 58.61,51.12 58.61,47.94 v57.91,47.24
  Bottom 0.254: v57.91,47.24 57.91,39.62 54.61,36.32 53.59,36.32 53.21,35.94 U5.57 | v47.75,52.83 47.75,55.12 47.09,55.78 U4.19
HORN  (via drill 0.6)
  Bottom 0.178: v39.12,40.06 38.88,39.82 R21.1
  Bottom 0.203: U5.10 46.23,41.46 45.28,42.42 39.37,42.42 | 39.37,42.42 39.37,40.31 v39.12,40.06 | 39.37,42.42 39.37,43.83 U1.3
HORN_IO
  Bottom 0.61: Q1.5 Q1.6 Q1.7 Q1.8 29.76,39.9 29.45,40.21 26.82,40.21 26.04,41 J1.B 26.75,43.23 CR1.2
INT_PWR
  Bottom 0.203: U11.2 10.44,15.56 10.67,15.79 10.67,18.54 10.41,18.8 7.87,18.8 7.37,19.3
  Bottom 0.406: C37.1 15.24,14.99 15.49,15.24 15.49,17.15 | 15.49,17.15 15.37,17.27 D5.A 15.49,17.27 | 15.49,17.27 15.49,19.56 | 15.49,17.15 15.49,17.27
  pour Bottom: 6.86,24.64 6.86,19.05 9.91,19.05 17.02,19.05 17.02,24.64
ISP0  (via drill 0.35)
  Top 0.254: v48.01,9.14 v48.01,30.73 | v48.01,34.04 v48.01,45.47
  Bottom 0.203: R11.1 v48.01,9.14
  Bottom 0.254: v48.01,45.47 48.77,45.47 49.02,45.21 49.02,43.18 48.81,42.96 U5.13 | v48.01,34.04 v48.01,30.73 | v48.01,9.14 48.01,5.33 47.75,5.08 47.12,5.08
  Bottom 0.406: SW1.2 47.12,5.08 SW1.1
ISP1
  Bottom 0.203: U5.38 61.49,41.96 62.74,43.22 R5.2
ISP_RX
  Bottom 0.254: U5.31 56.71,51.49 56.13,52.07 45.97,52.07 45.47,52.58 45.47,53.11 U4.15
ISP_TX
  Bottom 0.254: U5.32 57.22,52.77 56.79,53.19 U4.14
LED_A  (via drill 0.35, 0.6)
  Top 0.254: v39.12,50.66 46.08,50.66 46.99,51.56 55.41,51.56 55.55,51.42 v55.55,50.66
  Bottom 0.254: v55.55,50.66 55.71,50.5 U5.29 | R20.1 37.71,49.9 38.46,50.66 v39.12,50.66
LED_A_IO
  Bottom 0.305: J1.C 27.37,49.9 R15.2 R14.2
LED_E  (via drill 0.35, 0.6)
  Top 0.254: v45.21,51.56 37.61,51.56 v37.51,51.47
  Bottom 0.254: v45.21,51.56 55.63,51.56 56.21,50.98 U5.30 | v37.51,51.47 37.34,51.64 37.34,52.32 37.08,52.58 36.32,52.58 36.07,52.83 R19.1
LED_E_IO
  Bottom 0.305: J1.H 19.68,51.93 20.59,52.83 27.82,52.83 28.45,53.46 R13.2 R12.2
MOTOR_PHASE_1  (via drill 0.85)
  Top 1.27: J5.2 85.47,46.99 82.93,49.53 v78.83,49.53
  Top 1.778: v78.83,49.53 v77.42,49.53 v76.09,49.53 v74.68,49.53
  Bottom 0.305: 87.06,47.05 J5.2 87,46.55 R48.1
  Bottom 0.508: Q9.8 74.8,49.66 v74.68,49.53 | Q9.7 76.07,49.54 v76.09,49.53 | Q9.6 77.34,49.61 v77.42,49.53 | Q9.5 78.61,49.74 v78.83,49.53
  Bottom 0.813: D9.A 83.45,58.67
  Bottom 1.016: 83.45,58.67 89.14,58.67 91.93,55.89 91.93,52.31 87.06,47.44 87.06,47.05
MOTOR_PHASE_2  (via drill 0.85)
  Top 1.27: v74.68,34.8 75.69,34.8 | v78.99,34.8 80.77,36.58 80.77,39.62 81.28,40.13 J5.3
  Top 1.778: v74.68,34.8 v76.07,34.8 v77.48,34.8 v78.99,34.8
  Bottom 0.305: J5.3 87.69,39.43 R45.1
  Bottom 0.61: Q8.8 75.06,34.92 v74.68,34.8 | Q8.7 76.33,35.05 v76.07,34.8 | Q8.6 77.6,34.92 v77.48,34.8 | Q8.5 78.87,34.8 v78.99,34.8
  Bottom 1.016: D8.A 84.79,41.96 86.61,40.13 J5.3
MOTOR_PHASE_3  (via drill 0.85)
  Top 1.27: J5.4 84.58,33.53 80.26,29.21 80.26,21.59 79,20.33 v78.56,20.33 78.56,20.32 | 75.79,20.32 v75.8,20.3 | 77.17,20.3 v77.18,20.32
  Top 1.778: v74.42,20.32 75.79,20.32 | v75.8,20.3 77.17,20.3 | v77.18,20.32 78.56,20.32
  Bottom 0.305: R44.1 88.83,31.69 J5.4
  Bottom 0.61: Q7.8 74.8,20.7 v74.42,20.32 | Q7.7 76.07,20.58 v75.8,20.3 | Q7.6 77.34,20.48 v77.18,20.32 | Q7.5 78.61,20.38 v78.56,20.33
  Bottom 1.016: D7.A 84.79,35.22 86.49,33.53 J5.4
N$1
  Bottom 0.254: R41.1 71.25,23.24 71.63,23.62 72.64,23.62 73.01,23.99 U14.5
N$2
  Bottom 0.254: Q2.1 34.14,54.72 34.68,55.26 R19.2
N$3
  Bottom 0.203: U1.5 36.25,47.2 35.95,47.5 R10.2
N$4
  Bottom 0.305: LED1.C R43.2
N$5  (via drill 0.35)
  Bottom 0.203: v61.98,44.7 61.97,44.7 60.73,43.47 59.21,43.47
N$6
  Bottom 0.254: Q3.1 34.19,50.7 35.19,51.7 R20.2
N$7  (via drill 0.35)
  Bottom 0.203: v33.27,8.13 33.37,8.03 33.37,5.89
N$8
  Bottom 0.203: Q1.4 34.34,46.18 33.64,46.87 R10.1
N$9  (via drill 0.35)
  Bottom 0.203: v42.96,57.05 45.44,57.05
N$10  (via drill 0.35)
  Bottom 0.203: v61.8,43.3 61.63,43.13 60.94,43.13 60.77,42.97 59.27,42.97
N$11  (via drill 0.35)
  Top 0.305: v77.98,26.16 78.64,26.82 v78.64,29.54 v78.63,29.55
  Bottom 0.305: R41.2 73.41,22.35 73.91,22.86 73.91,23.62 76.2,25.91 77.72,25.91 v77.98,26.16 | v78.63,29.55 78.61,29.52 Q7.4
N$12
  Bottom 0.254: R58.1 LED13.A
N$13
  Bottom 0.254: R57.1 LED12.A
N$15
  Bottom 0.254: R17.1 28.97,24 U2.1
N$16
  Bottom 0.305: R33.2 3.4,13.99 U11.5
N$17
  Bottom 0.406: Q5.4 11.81,19.44 | 11.81,19.44 Q4.4 | U11.3 11.71,14.91 11.78,14.99 C37.2 12.82,16 12.57,16.25 D5.C 12.57,18.68 11.81,19.44
N$18
  Bottom 0.254: R39.1 71.08,50.76 71.37,51.05 72.14,51.05 72.46,51.38 U12.5
N$19  (via drill 0.35)
  Top 0.254: v78.49,58.17 78.49,54.36 v78.23,54.1
  Bottom 0.254: R39.2 73.91,50.84 73.91,52.58 75.44,54.1 v78.23,54.1 | v78.49,58.17 78.61,58.04 Q9.4
N$20
  Bottom 0.305: U13.5 72.75,37.7 72.39,37.34 71.63,37.34 71.25,36.96 R40.1
N$21
  Bottom 0.203: R50.1 LED5.A
N$22
  Bottom 0.254: R56.1 LED11.A
N$24  (via drill 0.35)
  Bottom 0.203: v61.18,42.55 61.1,42.47 59.22,42.47
N$26  (via drill 0.35)
  Top 0.305: v78.86,43.2 78.36,42.69 v78.36,39.16
  Bottom 0.305: R40.2 73.05,36.3 75.1,38.35 77.55,38.35 v78.36,39.16 | v78.86,43.2 Q8.4
N$27
  Bottom 0.203: R38.1 9.7,16.62 9.29,16.21 U11.1
N$28
  Bottom 0.254: LED10.A R55.1
N$31  (via drill 0.35)
  Bottom 0.203: v63.75,40.64 63.09,39.97 59.28,39.97
N$32
  Bottom 0.254: R53.1 LED8.A
N$33
  Bottom 0.203: R52.1 LED7.A
N$34
  Bottom 0.254: U15.5 73.01,15.36 71.38,13.73 R42.1
N$35
  Bottom 0.305: R42.2 76.06,12.3 78.61,14.86 Q6.4
N$37
  Bottom 0.254: R61.1 LED16.A
N$38
  Bottom 0.305: R44.2 90.12,33.48 LED2.C
N$39
  Bottom 0.203: LED3.C 91.86,41.27
  Bottom 0.305: 91.86,41.27 R45.2
N$40
  Bottom 0.305: R48.2 LED4.C
N$43
  Bottom 0.203: 46.99,62.85 C8.2
  Bottom 0.254: 46.99,62.85 46.99,59.44 46.58,59.03 U4.24
N$44
  Bottom 0.203: R51.1 LED6.A
N$45  (via drill 0.35)
  Bottom 0.203: v43.69,56.39 45.47,56.39
N$46
  Bottom 0.254: C8.1 45.39,63.05 U4.28
N$47
  Bottom 0.203: R18.2 36.04,66.2 D2.3 30.5,66.2 R7.1
N$48
  Bottom 0.254: C9.2 49.65,61.24 49.9,60.98 U4.2
N$49
  Bottom 0.254: C9.1 51.45,61.96 51.13,61.65 U4.1
N$50
  Bottom 0.254: C22.1 44.06,18.68 44.81,17.92 U6.11
N$53
  Bottom 0.254: U4.27 44.03,60.98 43.18,61.84 C13.1
N$54
  Bottom 0.254: LED17.A R62.1
N$55  (via drill 0.35)
  Bottom 0.203: v64.01,38.61 63.65,38.97 59.31,38.97
N$56
  Bottom 0.203: R54.1 LED9.A
N$57
  Bottom 0.305: R14.1 30.48,52.16 30.68,52.36 32.02,52.36 32.39,51.98 Q3.3
N$58
  Bottom 0.254: R12.1 30.48,56.22 31.95,56.22 32.16,56.01 Q2.3
N$60  (via drill 0.35)
  Bottom 0.254: v64.01,37.34 62.74,37.34 62.11,37.97 59.15,37.97
N$62  (via drill 0.35)
  Bottom 0.254: v64.01,36.32 63.75,36.32 63.25,36.83 62.23,36.83 61.6,37.46 59.13,37.46
N$64
  Bottom 0.254: U4.3 53.33,60.33 C14.1
N$65
  Bottom 0.178: R24.1 R25.2
N$66
  Bottom 0.254: R16.1 31.48,31.54 U3.1
N$67  (via drill 0.35)
  Bottom 0.203: v43.69,55.12 45.47,55.12
N$68  (via drill 0.35)
  Bottom 0.203: v43.69,53.85 45.21,53.85
N$69
  Bottom 0.254: U4.13 53.31,53.82 53.85,54.36 R63.1
N$70
  Bottom 0.254: R60.1 LED15.A
N$71
  Bottom 0.254: R59.1 LED14.A
N$72  (via drill 0.35)
  Bottom 0.203: v53.19,55.75 51.17,55.75
N$73  (via drill 0.35)
  Bottom 0.203: v53.12,57.74 51.05,57.74
N$76  (via drill 0.35)
  Bottom 0.203: v53.14,59.04 50.66,59.04
N$80  (via drill 0.35)
  Bottom 0.203: v57.66,32.26 57.66,34.56 57.22,34.99
PH1SENSE
  Bottom 0.254: R49.2 74.93,60.96 74.56,60.59 U10.4
  Bottom 0.61: Q9.1 74.83,58.34 | 76.07,58.32 Q9.2 | 77.34,58.34 Q9.3
  Bottom 1.27: 74.83,58.34 76.05,58.34 76.07,58.32 | 76.07,58.32 75.82,58.32 R49.2 | 76.07,58.32 77.32,58.32 77.34,58.34
PH2SENSE
  Bottom 0.254: R47.2 75.18,45.97 75.04,46.12 U9.4
  Bottom 0.61: Q8.1 75.05,43.44 | 76.32,43.44 Q8.2 | 77.61,43.45 Q8.3
  Bottom 1.27: 75.05,43.44 76.32,43.44 | 76.32,43.44 77.61,43.45 | 76.32,43.44 76.58,43.69 R47.2
PH3SENSE
  Bottom 0.254: R46.2 76.39,31.94 | 76.39,31.94 76.14,31.94 75.93,32.15 U8.4 | 76.39,31.94 76.58,31.94
  Bottom 0.61: Q7.1 74.8,29.59 | Q7.2 76.07,29.59 | Q7.3 77.34,29.61
  Bottom 1.27: 74.8,29.59 76.07,29.59 76.58,29.59 | 76.58,29.59 77.32,29.59 77.34,29.61 | 76.58,29.59 76.58,31.94
PHASE1
  Bottom 0.254: U12.3 67.95,53.97 67.07,54.85 R34.1 67.07,54.88 65.02,52.83 65.02,43.18 62.31,40.46 U5.41
PHASE2
  Bottom 0.254: U13.3 68.34,39.86 67.29,40.91 R35.1 66.51,41.87 64.1,39.46 U5.43
PHASE3  (via drill 0.35)
  Top 0.254: v62.8,38.3 62.8,36.13 v62.74,36.07
  Bottom 0.254: U14.3 68.09,26.65 67.42,27.32 R36.1 63.82,28.63 62.74,29.72 v62.74,36.07 | U5.45 62.63,38.46 v62.8,38.3
RESET_N  (via drill 0.35)
  Top 0.254: v49.53,13.72 62.48,13.72 v62.74,13.46
  Bottom 0.254: v49.53,13.72 49.71,13.89 U5.64 | v62.74,13.46 62.85,13.35 R32.2 64.79,13.37 U7.1
RESETLED
  Bottom 0.254: U7.3 68.54,14.38 67.43,15.49 R53.2
RXD0_232  (via drill 0.35)
  Top 0.254: v28.45,56.39 28.45,64.26 30.23,66.04 48.01,66.04 48.26,65.79 48.26,58.17 v48.77,57.66
  Bottom 0.254: v48.77,57.66 49.35,57.07 U4.8 54.53,57.07 59.44,61.98 64.77,61.98 65.28,62.48 J3.2 | v28.45,56.39 R13.1
RXD1  (via drill 0.35)
  Top 0.254: v46.99,54.36 47.24,54.36 49.02,52.58 v60.71,52.58
  Bottom 0.254: U4.17 46.86,54.48 v46.99,54.36 | U5.39 61.81,41.46 64.01,43.66 64.01,51.82 63.25,52.58 v60.71,52.58
RXD1_232
  Bottom 0.254: J3.5 57.66,61.21 54.81,58.37 U4.6
SPEED  (via drill 0.6)
  Bottom 0.254: U5.14 41.12,43.47 40.39,44.2 40.39,56.9 39.75,57.54 v38.78,57.54 38.77,57.52 38.77,58 37.45,59.32 C4.1 36.04,59.34 D4.3 33.25,59.32 R9.1
SPEED_IO  (via drill 0.35)
  Bottom 0.254: R9.2 R3.2 26.03,57.52 v26.04,57.49 v26.04,57.48 26.04,56.9 J1.D
STATUS_0  (via drill 0.6)
  Bottom 0.203: U5.63 50.21,8.81 v49.78,8.38 R55.2
STATUS_1  (via drill 0.6)
  Bottom 0.203: U5.62 50.71,9.24 v51.56,8.38 R56.2
STATUS_2  (via drill 0.6)
  Bottom 0.203: U5.61 51.21,10.51 v53.34,8.38 R57.2
STATUS_3  (via drill 0.6)
  Bottom 0.203: U5.60 51.71,11.79 v55.12,8.38 R58.2
STATUS_4  (via drill 0.35, 0.6)
  Top 0.203: v51.78,36.58 51.82,36.54 51.82,27.91 v52.32,27.4
  Bottom 0.203: v51.78,36.58 52.21,36.15 U5.59 | v52.32,27.4 52.32,12.95 v56.9,8.38 R59.2
STATUS_5  (via drill 0.35, 0.6)
  Top 0.203: v52.83,36.58 53.34,36.07 53.34,28.45 v53.09,28.19
  Bottom 0.203: v52.83,36.58 52.71,36.45 U5.58 | v53.09,28.19 52.92,28.03 52.92,14.14 v58.67,8.38 R60.2
STATUS_6  (via drill 0.6)
  Bottom 0.203: U5.54 54.71,33.43 55.12,33.02 55.12,28.7 53.37,26.95 53.37,15.46 60.41,8.43 v60.48,8.43 60.45,8.39 R61.2
STATUS_7  (via drill 0.35, 0.6)
  Top 0.203: v55.88,36.58 55.37,36.07 55.37,27.94 v54.86,27.43
  Bottom 0.203: R62.2 v62.23,8.38 53.85,16.76 53.85,26.42 v54.86,27.43 | v55.88,36.58 56.21,36.25 U5.51
SWDCLK  (via drill 0.35)
  Top 0.203: v64.26,8.89 64.26,6.35 65.02,5.59 v72.14,5.59
  Bottom 0.203: U5.52 55.71,33.7 56.22,33.19 56.22,16.93 v64.26,8.89 | v72.14,5.59 J4.4
SWDIO  (via drill 0.35)
  Top 0.203: v72.14,6.86 72.1,6.82 72.07,6.86 v66.55,6.86
  Bottom 0.203: v72.14,6.86 J4.2 | U5.53 55.21,33.44 55.63,33.02 55.63,16.51 64.01,8.13 66.04,8.13 66.55,7.62 v66.55,6.86
SWO  (via drill 0.35)
  Top 0.203: v63.5,10.67 63.5,5.08 64.26,4.32 v72.14,4.32
  Bottom 0.203: U5.50 56.71,17.59 63.5,10.8 v63.5,10.67 | v72.14,4.32 J4.6
TACH  (via drill 0.35, 0.6)
  Top 0.203: v41.4,35.31 41.91,35.81 v46.99,35.81
  Bottom 0.203: U5.1 47.71,36.53 v46.99,35.81
  Bottom 0.254: v41.4,35.31 41.15,35.31 39.62,36.83 R23.1 C6.1 39,31.89 38.73,31.62 U3.4 | U5.1 48.9,36.96 49.53,37.59 49.53,44.77 50.21,45.45 U5.18
TACH_IO  (via drill 0.6)
  Bottom 0.254: J1.J 22.76,42.52 26.16,39.12 28.45,39.12 29.21,38.35 v29.21,36.32 29.21,35.31 29.97,34.54 R16.2
TRANS  (via drill 0.6)
  Bottom 0.254: U5.16 41.64,44.47 41.4,44.7 41.4,63.5 40.52,64.38 v40.34,64.38 | C2.1 R18.1
  Bottom 0.305: C2.1 v40.34,64.38
TRANS_IO
  Bottom 0.254: J1.G 19.68,57.28 26.79,64.38 R1.2
  Bottom 0.305: R1.2 R7.2
TXD0_232  (via drill 0.35)
  Top 0.203: v29.2,52.66 29.2,63.99 29.21,64.01
  Top 0.254: 29.21,64.01 30.73,65.53 47.75,65.53 47.75,57.48 v48.85,56.39
  Bottom 0.203: 28.45,51.91 v29.2,52.66
  Bottom 0.254: v48.85,56.39 48.9,56.44 U4.9 54.91,56.44 59.69,61.21 65.02,61.21 67.82,64.01 J3.1
  Bottom 0.305: R15.1 28.45,51.91
TXD1  (via drill 0.35)
  Top 0.254: v60.17,54.52 v52.58,54.52
  Bottom 0.254: U4.12 51.16,54.52 v52.58,54.52 | v60.17,54.52 63.72,54.52 64.52,53.72 64.52,43.43 62.05,40.96 U5.40
TXD1_232  (via drill 0.35)
  Top 0.254: J3.6 55.12,63.75 55.63,63.25 v55.63,56.13
  Bottom 0.254: v55.63,56.13 55.12,55.63 54.18,55.63 53.67,55.12 U4.11
USB_DM
  Bottom 0.203: R27.2 44.52,38.48 45.51,39.46 U5.6
USB_DP
  Bottom 0.203: U5.5 45.78,38.96 44.39,37.57 42.59,37.57 R28.2
USB_UP_LED  (via drill 0.35)
  Top 0.203: v41.91,30.73 41.91,32.77 40.64,34.04 40.64,35.56 41.4,36.32 41.4,44.96 v42.93,46.48
  Bottom 0.203: v41.91,30.73 42.04,30.61 42.04,22.48 31.89,12.33 R54.2 | v42.93,46.48 42.94,46.47 U5.17
USB_VBUS  (via drill 0.35)
  Top 0.203: v43.94,34.8 v46.99,34.8
  Bottom 0.178: R26.1 R24.2 40.43,11.59 40.43,13.81 C7.1
  Bottom 0.203: C7.1 39.51,17.27 43.85,21.61 43.85,34.7 v43.94,34.8 | 50.28,37.37 47.71,34.8 v46.99,34.8 | 54.21,43.94 U5.26
  Bottom 0.254: 50.28,37.37 50.28,43.17 50.8,43.69 53.95,43.69 54.21,43.94
VBUS
  Bottom 0.254: J2.1 35.34,8.64 R26.2
VDDA  (via drill 0.35)
  Top 0.178: R29.2 C15.1
  Top 0.254: C15.1 53.23,41.4 C11.2 C10.2 53.23,43.91 52.69,44.45 v52.69,44.67
  Top 0.305: C16.1 53.23,45.48 53.57,45.13 v53.57,44.63
  Top 0.406: C15.1 53.79,39.57 54.1,39.88 54.1,44.09 v53.57,44.63
  Bottom 0.203: v53.57,44.63 52.71,45.49 U5.23 | U5.22 52.21,45.15 v52.69,44.67

## Text on the board
tPlace: 12V | GNDIO | GND
bPlace: 12V | GNDIO | GPS | ACCEL | TRANS | SPEED | ENA | ARM | TACH | HORN | 15V | GNDIO
tNames: BoatCC 20181103 | 1 | GND | 3.3V | GND | 3.3V | GND | 3.3V | 3.3V | GND | GND | 3.3V | Boat Cruise Control / Paul Hittel / Frank Schwab
bNames: BoatCC 20181103 | 1 | GND | TRANS | 3.3V | ACCEL | TRANS_IO | SPEED | GND | 3.3V | ENA | GND | ARM | 3.3V | 35 | 36 | 37 | 42 | HORN | 44 | TACH_IO | 46 | 47 | TACH | EXTRA | 3.3V | EXTRA_IO | GND | RESET | 15V | 12V | 3.3V | GND | USB UP | +12V | GND | ISP | 3.3V | GND | GND | RESET | 0 | 1 | 2 | 3 | 4 | 5 | 6 | 7